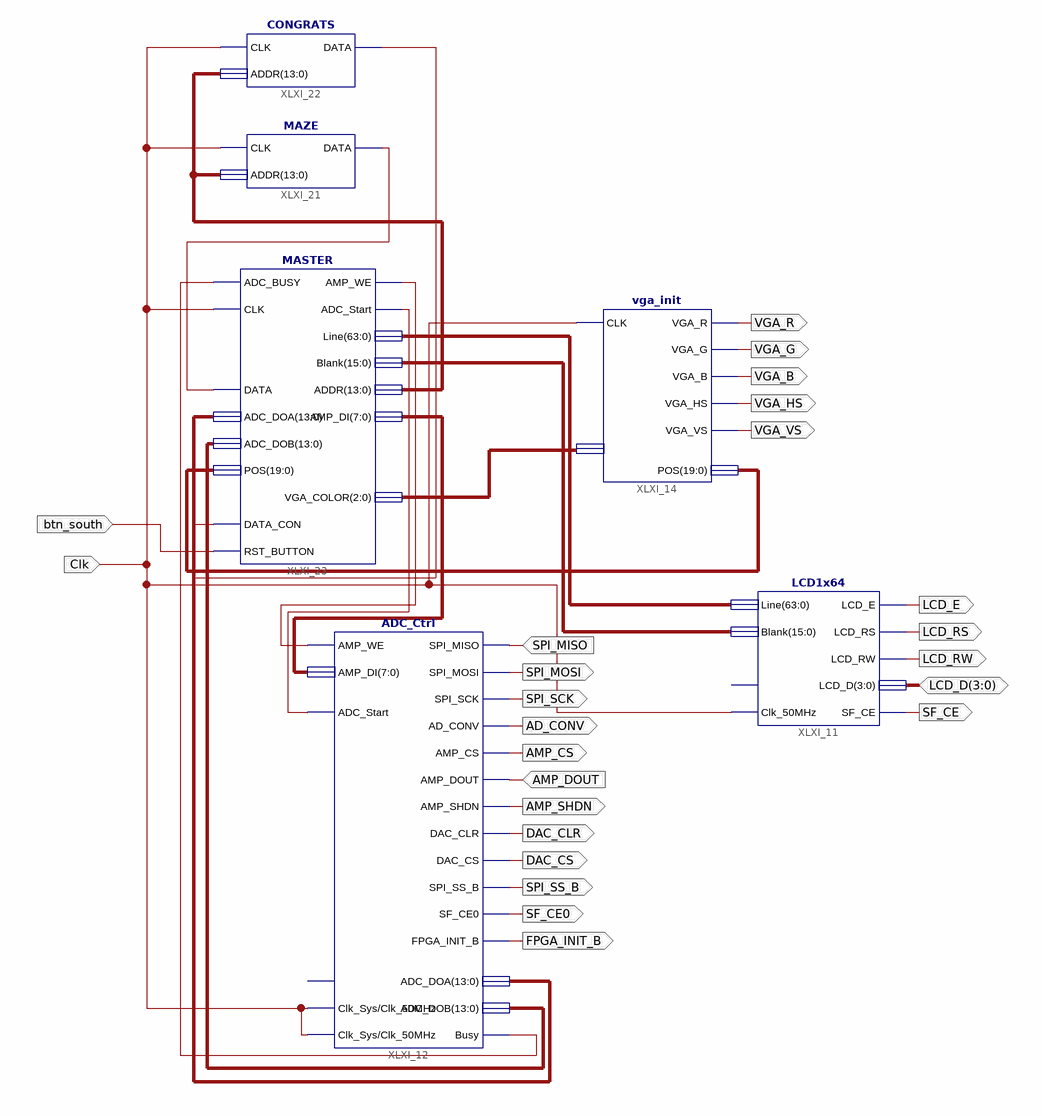
[diagram p0: schematic sheet 1]
// Xilinx ISE schematic schema1.sch (spartan3e) as structural Verilog: 6 symbols, 24 ports
module schema1 (
  input  Clk,
  input  SPI_MISO,
  input  AMP_DOUT,
  input  btn_south,
  inout  [3:0] LCD_D,
  output VGA_R,
  output VGA_G,
  output VGA_B,
  output VGA_HS,
  output VGA_VS,
  output LCD_E,
  output LCD_RS,
  output LCD_RW,
  output SPI_MOSI,
  output SPI_SCK,
  output AD_CONV,
  output AMP_CS,
  output AMP_SHDN,
  output DAC_CLR,
  output DAC_CS,
  output SF_CE0,
  output FPGA_INIT_B,
  output SPI_SS_B,
  output SF_CE
);

  wire XLXN_45, XLXN_53, XLXN_58, XLXN_63, XLXN_68;
  wire [2:0] XLXN_50;
  wire [7:0] XLXN_55;
  wire [13:0] XLXN_56, XLXN_57, XLXN_65;
  wire [15:0] XLXN_52;
  wire [19:0] XLXN_64;
  wire [63:0] XLXN_51;

  LCD1x64 XLXI_11 (
    .Clk_50MHz(Clk), .Line(XLXN_51), .Blank(XLXN_52), .LCD_D(LCD_D), .LCD_E(LCD_E), .LCD_RW(LCD_RW),
    .LCD_RS(LCD_RS), .SF_CE(SF_CE));  // open: Reset
  ADC_Ctrl XLXI_12 (
    .Clk_Sys(Clk), .AMP_WE(XLXN_53), .ADC_Start(XLXN_63), .SPI_MISO(SPI_MISO), .AMP_DOUT(AMP_DOUT),
    .AMP_DI(XLXN_55), .Busy(XLXN_58), .SPI_MOSI(SPI_MOSI), .SPI_SCK(SPI_SCK), .AMP_CS(AMP_CS),
    .AMP_SHDN(AMP_SHDN), .AD_CONV(AD_CONV), .DAC_CS(DAC_CS), .DAC_CLR(DAC_CLR), .SPI_SS_B(SPI_SS_B),
    .SF_CE0(SF_CE0), .FPGA_INIT_B(FPGA_INIT_B), .ADC_DOA(XLXN_56), .ADC_DOB(XLXN_57), .Clk_50MHz(Clk));  // open: Reset
  vga_init XLXI_14 (
    .CLK(Clk), .VGA_COLOR(XLXN_50), .VGA_R(VGA_R), .VGA_G(VGA_G), .VGA_B(VGA_B), .VGA_HS(VGA_HS),
    .VGA_VS(VGA_VS), .POS(XLXN_64));
  MAZE XLXI_21 (.CLK(Clk), .ADDR(XLXN_65), .DATA(XLXN_45));
  CONGRATS XLXI_22 (.CLK(Clk), .ADDR(XLXN_65), .DATA(XLXN_68));
  MASTER XLXI_23 (
    .ADC_BUSY(XLXN_58), .RST_BUTTON(btn_south), .CLK(Clk), .DATA(XLXN_45), .DATA_CON(XLXN_68),
    .ADC_DOA(XLXN_56), .ADC_DOB(XLXN_57), .POS(XLXN_64), .AMP_WE(XLXN_53), .ADC_Start(XLXN_63),
    .Line(XLXN_51), .Blank(XLXN_52), .ADDR(XLXN_65), .VGA_COLOR(XLXN_50), .AMP_DI(XLXN_55));
endmodule
